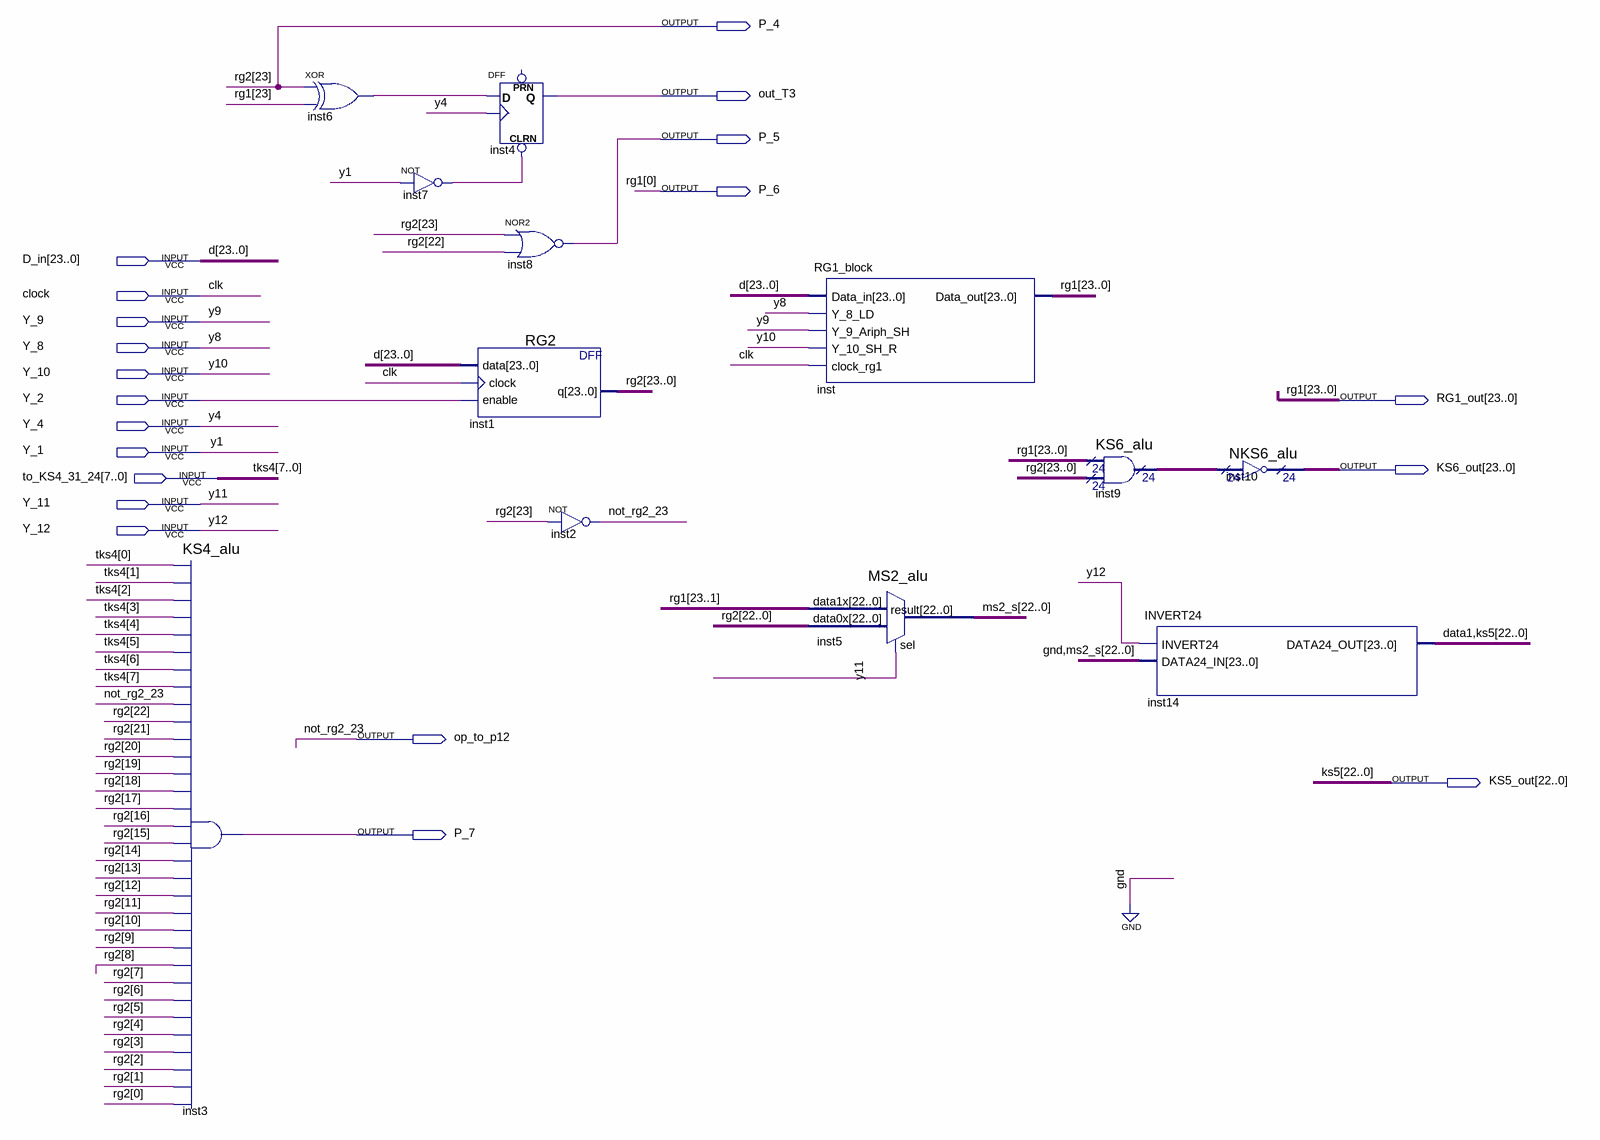
[diagram p0: schematic sheet]
// Quartus schematic RG12_T3_MS2_KS456.bdf as structural Verilog: 12 symbols, 20 pins
module RG12_T3_MS2_KS456 (
  input  [23:0] D_in,
  input  clock,
  input  Y_9,
  input  Y_8,
  input  Y_10,
  input  Y_2,
  input  Y_4,
  input  Y_1,
  input  [7:0] to_KS4_31_24,
  input  Y_11,
  input  Y_12,
  output P_4,
  output out_T3,
  output P_5,
  output P_6,
  output [23:0] RG1_out,
  output [23:0] KS6_out,
  output op_to_p12,
  output [22:0] KS5_out,
  output P_7
);

  wire data1, inst6_out, inst7_out;
  wire [22:0] ms2_s, rg2;
  wire [23:0] inst9_result;

  KS4_alu inst3 (
    .data0(to_KS4_31_24[0]), .data1(to_KS4_31_24[1]), .data2(to_KS4_31_24[2]), .data3(to_KS4_31_24[3]),
    .data4(to_KS4_31_24[4]), .data5(to_KS4_31_24[5]), .data6(to_KS4_31_24[6]), .data7(to_KS4_31_24[7]),
    .data8(op_to_p12), .data9(rg2[22]), .data10(rg2[21]), .data11(rg2[20]), .data12(rg2[19]),
    .data13(rg2[18]), .data14(rg2[17]), .data15(rg2[16]), .data16(rg2[15]), .data17(rg2[14]),
    .data18(rg2[13]), .data19(rg2[12]), .data20(rg2[11]), .data21(rg2[10]), .data22(rg2[9]), .data23(rg2[8]),
    .data24(rg2[7]), .data25(rg2[6]), .data26(rg2[5]), .data27(rg2[4]), .data28(rg2[3]), .data29(rg2[2]),
    .data30(rg2[1]), .data31(rg2[0]), .result(P_7));
  xor inst6 (inst6_out, P_4, RG1_out[23]);
  not inst7 (inst7_out, Y_1);
  DFF inst4 (.CLRN(inst7_out), .CLK(Y_4), .D(inst6_out), .Q(out_T3));  // open: PRN
  nor inst8 (P_5, P_4, rg2[22]);
  RG2 inst1 (.data(D_in), .clock(clock), .enable(Y_2), .q({P_4, rg2}));
  not inst2 (op_to_p12, P_4);
  RG1_block inst (
    .Data_in(D_in), .Y_8_LD(Y_8), .Y_9_Ariph_SH(Y_9), .Y_10_SH_R(Y_10), .clock_rg1(clock),
    .Data_out({RG1_out[23:1], P_6}));
  MS2_alu inst5 (.data1x(RG1_out[23:1]), .data0x(rg2), .sel(Y_11), .result(ms2_s));
  KS6_alu inst9 (.data0x({RG1_out[23:1], P_6}), .data1x({P_4, rg2}), .result(inst9_result));
  INVERT24 inst14 (.INVERT24(Y_12), .DATA24_IN({1'b0, ms2_s}), .DATA24_OUT({data1, KS5_out}));
  NKS6_alu inst10 (.data(inst9_result), .result(KS6_out));

  assign RG1_out[0] = P_6;

  // Other names for the same wires on the sheet: clk = clock; d[23:0] = D_in; ks5[22:0] = KS5_out;
  //   not_rg2_23 = op_to_p12; rg1[23:0] = {RG1_out[23:1], P_6}; rg2[23] = P_4; tks4[7:0] = to_KS4_31_24; y1 = Y_1;
  //   y4 = Y_4; y8 = Y_8; y9 = Y_9; y10 = Y_10; y11 = Y_11; y12 = Y_12
endmodule
